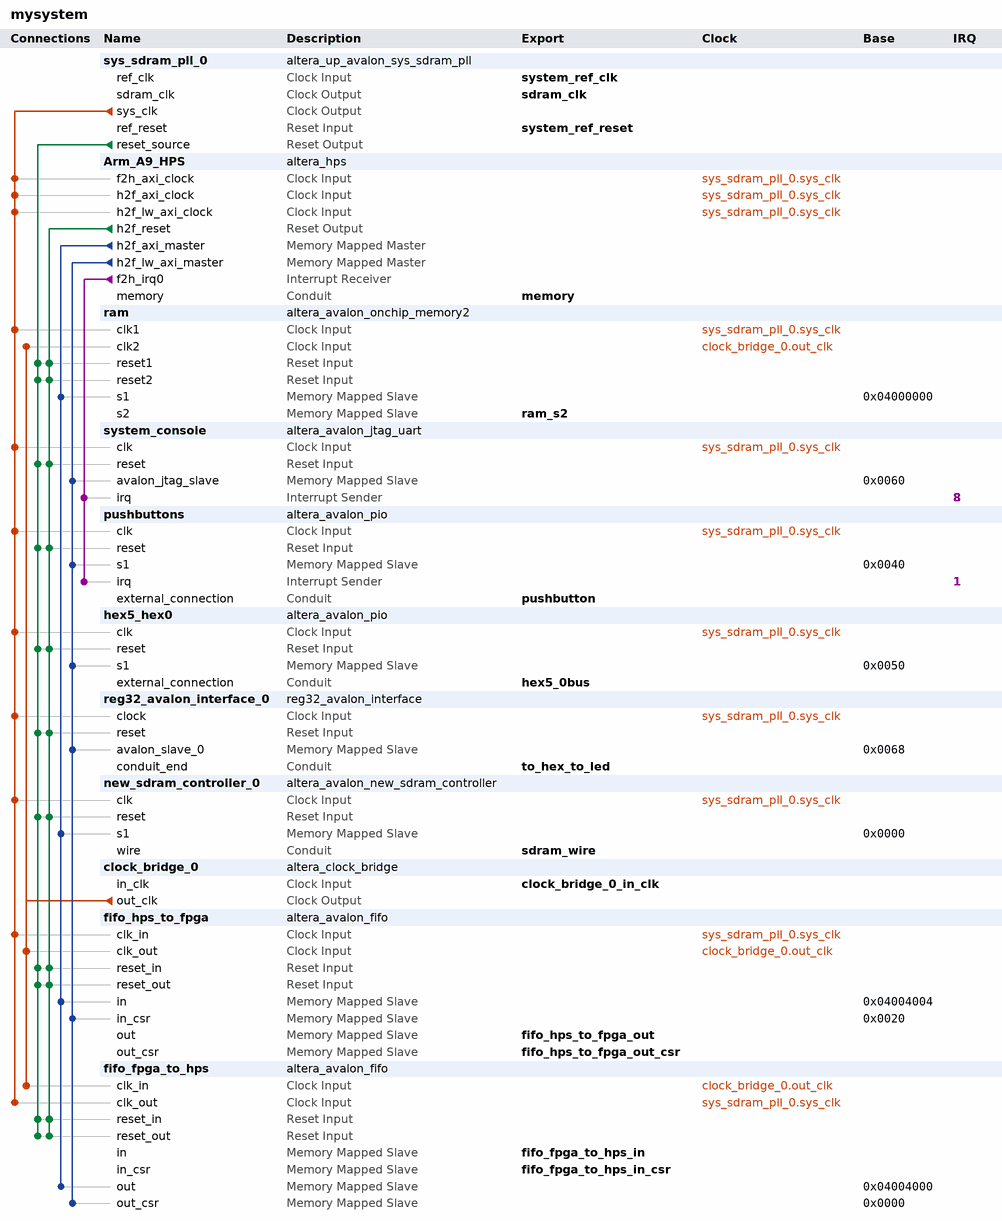
[diagram p0: system contents]
# Platform Designer (Qsys) system mysystem, Cyclone V 5CSEMA5F31C6
# Parameters at their usual value, and those the tool derives, are not listed.
package require -exact qsys 15.0
create_system mysystem
set_project_property DEVICE_FAMILY {Cyclone V}
set_project_property DEVICE 5CSEMA5F31C6

add_instance sys_sdram_pll_0 altera_up_avalon_sys_sdram_pll 15.0
set_instance_parameter_value sys_sdram_pll_0 CV_boards DE1-SoC
set_instance_parameter_value sys_sdram_pll_0 gui_outclk 50.0
set_instance_parameter_value sys_sdram_pll_0 gui_refclk 50.0

add_instance Arm_A9_HPS altera_hps 15.0
set_instance_parameter_value Arm_A9_HPS EMAC1_Mode N/A
set_instance_parameter_value Arm_A9_HPS EMAC1_PinMuxing Unused
set_instance_parameter_value Arm_A9_HPS F2SCLK_COLDRST_Enable false
set_instance_parameter_value Arm_A9_HPS F2SCLK_DBGRST_Enable false
set_instance_parameter_value Arm_A9_HPS F2SCLK_WARMRST_Enable false
set_instance_parameter_value Arm_A9_HPS F2SINTERRUPT_Enable true
set_instance_parameter_value Arm_A9_HPS F2S_Width 2
set_instance_parameter_value Arm_A9_HPS FPGA_PERIPHERAL_OUTPUT_CLOCK_FREQ_EMAC0_GTX_CLK 100
set_instance_parameter_value Arm_A9_HPS FPGA_PERIPHERAL_OUTPUT_CLOCK_FREQ_EMAC0_MD_CLK 2.5
set_instance_parameter_value Arm_A9_HPS FPGA_PERIPHERAL_OUTPUT_CLOCK_FREQ_EMAC1_GTX_CLK 100
set_instance_parameter_value Arm_A9_HPS FPGA_PERIPHERAL_OUTPUT_CLOCK_FREQ_EMAC1_MD_CLK 2.5
set_instance_parameter_value Arm_A9_HPS HPS_PROTOCOL DDR3
set_instance_parameter_value Arm_A9_HPS I2C0_Mode N/A
set_instance_parameter_value Arm_A9_HPS I2C0_PinMuxing Unused
set_instance_parameter_value Arm_A9_HPS I2C1_Mode N/A
set_instance_parameter_value Arm_A9_HPS I2C1_PinMuxing Unused
set_instance_parameter_value Arm_A9_HPS LWH2F_Enable true
set_instance_parameter_value Arm_A9_HPS MEM_BANKADDR_WIDTH 3
set_instance_parameter_value Arm_A9_HPS MEM_CLK_FREQ 300.0
set_instance_parameter_value Arm_A9_HPS MEM_CLK_FREQ_MAX 400.0
set_instance_parameter_value Arm_A9_HPS MEM_COL_ADDR_WIDTH 8
set_instance_parameter_value Arm_A9_HPS MEM_DQ_WIDTH 8
set_instance_parameter_value Arm_A9_HPS MEM_DRV_STR RZQ/6
set_instance_parameter_value Arm_A9_HPS MEM_ROW_ADDR_WIDTH 12
set_instance_parameter_value Arm_A9_HPS MEM_RTT_NOM RZQ/6
set_instance_parameter_value Arm_A9_HPS MEM_RTT_WR {Dynamic ODT off}
set_instance_parameter_value Arm_A9_HPS MEM_TCL 7
set_instance_parameter_value Arm_A9_HPS MEM_TFAW_NS 37.5
set_instance_parameter_value Arm_A9_HPS MEM_TINIT_US 499
set_instance_parameter_value Arm_A9_HPS MEM_TMRD_CK 3
set_instance_parameter_value Arm_A9_HPS MEM_TRAS_NS 40.0
set_instance_parameter_value Arm_A9_HPS MEM_TRCD_NS 15.0
set_instance_parameter_value Arm_A9_HPS MEM_TREFI_US 7.0
set_instance_parameter_value Arm_A9_HPS MEM_TRFC_NS 75.0
set_instance_parameter_value Arm_A9_HPS MEM_TRP_NS 15.0
set_instance_parameter_value Arm_A9_HPS MEM_TWTR 2
set_instance_parameter_value Arm_A9_HPS MEM_VENDOR JEDEC
set_instance_parameter_value Arm_A9_HPS MEM_WTCL 6
set_instance_parameter_value Arm_A9_HPS QSPI_Mode N/A
set_instance_parameter_value Arm_A9_HPS QSPI_PinMuxing Unused
set_instance_parameter_value Arm_A9_HPS REF_CLK_FREQ 125.0
set_instance_parameter_value Arm_A9_HPS S2F_Width 3
set_instance_parameter_value Arm_A9_HPS SDIO_Mode N/A
set_instance_parameter_value Arm_A9_HPS SDIO_PinMuxing Unused
set_instance_parameter_value Arm_A9_HPS SPIM1_Mode N/A
set_instance_parameter_value Arm_A9_HPS SPIM1_PinMuxing Unused
set_instance_parameter_value Arm_A9_HPS STM_Enable false
set_instance_parameter_value Arm_A9_HPS TIMING_BOARD_AC_SKEW 0.02
set_instance_parameter_value Arm_A9_HPS TIMING_BOARD_AC_TO_CK_SKEW 0.0
set_instance_parameter_value Arm_A9_HPS TIMING_BOARD_DQ_TO_DQS_SKEW 0.0
set_instance_parameter_value Arm_A9_HPS TIMING_BOARD_MAX_CK_DELAY 0.6
set_instance_parameter_value Arm_A9_HPS TIMING_BOARD_MAX_DQS_DELAY 0.6
set_instance_parameter_value Arm_A9_HPS TIMING_BOARD_SKEW_BETWEEN_DQS 0.02
set_instance_parameter_value Arm_A9_HPS TIMING_BOARD_SKEW_CKDQS_DIMM_MAX 0.01
set_instance_parameter_value Arm_A9_HPS TIMING_BOARD_SKEW_CKDQS_DIMM_MIN -0.01
set_instance_parameter_value Arm_A9_HPS TIMING_BOARD_SKEW_WITHIN_DQS 0.02
set_instance_parameter_value Arm_A9_HPS TIMING_TDH 125
set_instance_parameter_value Arm_A9_HPS TIMING_TDQSCK 400
set_instance_parameter_value Arm_A9_HPS TIMING_TDQSQ 120
set_instance_parameter_value Arm_A9_HPS TIMING_TDS 50
set_instance_parameter_value Arm_A9_HPS TIMING_TIH 250
set_instance_parameter_value Arm_A9_HPS TIMING_TIS 175
set_instance_parameter_value Arm_A9_HPS TIMING_TQSH 0.38
set_instance_parameter_value Arm_A9_HPS UART0_Mode N/A
set_instance_parameter_value Arm_A9_HPS UART0_PinMuxing Unused
set_instance_parameter_value Arm_A9_HPS USB1_Mode N/A
set_instance_parameter_value Arm_A9_HPS USB1_PinMuxing Unused
set_instance_parameter_value Arm_A9_HPS desired_cfg_clk_mhz 100.0
set_instance_parameter_value Arm_A9_HPS desired_qspi_clk_mhz 400.0

add_instance ram altera_avalon_onchip_memory2 15.0
set_instance_parameter_value ram dataWidth 32
set_instance_parameter_value ram dualPort true
set_instance_parameter_value ram initMemContent true
set_instance_parameter_value ram initializationFileName onchip_mem.hex
set_instance_parameter_value ram memorySize 16384

add_instance system_console altera_avalon_jtag_uart 15.0
set_instance_parameter_value system_console simInteractiveOptions NO_INTERACTIVE_WINDOWS

add_instance pushbuttons altera_avalon_pio 15.0
set_instance_parameter_value pushbuttons bitClearingEdgeCapReg true
set_instance_parameter_value pushbuttons captureEdge true
set_instance_parameter_value pushbuttons direction Input
set_instance_parameter_value pushbuttons edgeType FALLING
set_instance_parameter_value pushbuttons generateIRQ true
set_instance_parameter_value pushbuttons irqType EDGE
set_instance_parameter_value pushbuttons simDoTestBenchWiring true
set_instance_parameter_value pushbuttons width 4

add_instance hex5_hex0 altera_avalon_pio 15.0
set_instance_parameter_value hex5_hex0 direction Output
set_instance_parameter_value hex5_hex0 width 32

add_instance reg32_avalon_interface_0 reg32_avalon_interface 1.0

add_instance new_sdram_controller_0 altera_avalon_new_sdram_controller 15.0
set_instance_parameter_value new_sdram_controller_0 TAC 5.5
set_instance_parameter_value new_sdram_controller_0 TRCD 20.0
set_instance_parameter_value new_sdram_controller_0 TRP 20.0
set_instance_parameter_value new_sdram_controller_0 casLatency 3
set_instance_parameter_value new_sdram_controller_0 columnWidth 10
set_instance_parameter_value new_sdram_controller_0 dataWidth 16
set_instance_parameter_value new_sdram_controller_0 generateSimulationModel false
set_instance_parameter_value new_sdram_controller_0 model single_Micron_MT48LC4M32B2_7_chip
set_instance_parameter_value new_sdram_controller_0 numberOfBanks 4
set_instance_parameter_value new_sdram_controller_0 numberOfChipSelects 1
set_instance_parameter_value new_sdram_controller_0 powerUpDelay 100.0
set_instance_parameter_value new_sdram_controller_0 refreshPeriod 15.625
set_instance_parameter_value new_sdram_controller_0 rowWidth 13

add_instance clock_bridge_0 altera_clock_bridge 15.0
set_instance_parameter_value clock_bridge_0 DERIVED_CLOCK_RATE 0
set_instance_parameter_value clock_bridge_0 EXPLICIT_CLOCK_RATE 0

add_instance fifo_hps_to_fpga altera_avalon_fifo 15.0
set_instance_parameter_value fifo_hps_to_fpga bitsPerSymbol 16
set_instance_parameter_value fifo_hps_to_fpga channelWidth 8
set_instance_parameter_value fifo_hps_to_fpga errorWidth 8
set_instance_parameter_value fifo_hps_to_fpga fifoDepth 128
set_instance_parameter_value fifo_hps_to_fpga fifoInputInterfaceOptions AVALONMM_WRITE
set_instance_parameter_value fifo_hps_to_fpga fifoOutputInterfaceOptions AVALONMM_READ
set_instance_parameter_value fifo_hps_to_fpga singleClockMode false
set_instance_parameter_value fifo_hps_to_fpga symbolsPerBeat 2
set_instance_parameter_value fifo_hps_to_fpga useIRQ false
set_instance_parameter_value fifo_hps_to_fpga usePacket true
set_instance_parameter_value fifo_hps_to_fpga useReadControl true

add_instance fifo_fpga_to_hps altera_avalon_fifo 15.0
set_instance_parameter_value fifo_fpga_to_hps bitsPerSymbol 16
set_instance_parameter_value fifo_fpga_to_hps channelWidth 8
set_instance_parameter_value fifo_fpga_to_hps errorWidth 8
set_instance_parameter_value fifo_fpga_to_hps fifoDepth 128
set_instance_parameter_value fifo_fpga_to_hps fifoInputInterfaceOptions AVALONMM_WRITE
set_instance_parameter_value fifo_fpga_to_hps fifoOutputInterfaceOptions AVALONMM_READ
set_instance_parameter_value fifo_fpga_to_hps singleClockMode false
set_instance_parameter_value fifo_fpga_to_hps symbolsPerBeat 2
set_instance_parameter_value fifo_fpga_to_hps useIRQ false
set_instance_parameter_value fifo_fpga_to_hps usePacket true
set_instance_parameter_value fifo_fpga_to_hps useReadControl true

# connections
add_connection clock_bridge_0.out_clk fifo_fpga_to_hps.clk_in clock
add_connection clock_bridge_0.out_clk fifo_hps_to_fpga.clk_out clock
add_connection clock_bridge_0.out_clk ram.clk2 clock
add_connection sys_sdram_pll_0.sys_clk Arm_A9_HPS.f2h_axi_clock clock
add_connection sys_sdram_pll_0.sys_clk Arm_A9_HPS.h2f_axi_clock clock
add_connection sys_sdram_pll_0.sys_clk Arm_A9_HPS.h2f_lw_axi_clock clock
add_connection sys_sdram_pll_0.sys_clk fifo_fpga_to_hps.clk_out clock
add_connection sys_sdram_pll_0.sys_clk fifo_hps_to_fpga.clk_in clock
add_connection sys_sdram_pll_0.sys_clk hex5_hex0.clk clock
add_connection sys_sdram_pll_0.sys_clk new_sdram_controller_0.clk clock
add_connection sys_sdram_pll_0.sys_clk pushbuttons.clk clock
add_connection sys_sdram_pll_0.sys_clk ram.clk1 clock
add_connection sys_sdram_pll_0.sys_clk reg32_avalon_interface_0.clock clock
add_connection sys_sdram_pll_0.sys_clk system_console.clk clock
add_connection Arm_A9_HPS.h2f_reset fifo_fpga_to_hps.reset_in reset
add_connection Arm_A9_HPS.h2f_reset fifo_fpga_to_hps.reset_out reset
add_connection Arm_A9_HPS.h2f_reset fifo_hps_to_fpga.reset_in reset
add_connection Arm_A9_HPS.h2f_reset fifo_hps_to_fpga.reset_out reset
add_connection Arm_A9_HPS.h2f_reset hex5_hex0.reset reset
add_connection Arm_A9_HPS.h2f_reset new_sdram_controller_0.reset reset
add_connection Arm_A9_HPS.h2f_reset pushbuttons.reset reset
add_connection Arm_A9_HPS.h2f_reset ram.reset1 reset
add_connection Arm_A9_HPS.h2f_reset ram.reset2 reset
add_connection Arm_A9_HPS.h2f_reset reg32_avalon_interface_0.reset reset
add_connection Arm_A9_HPS.h2f_reset system_console.reset reset
add_connection sys_sdram_pll_0.reset_source fifo_fpga_to_hps.reset_in reset
add_connection sys_sdram_pll_0.reset_source fifo_fpga_to_hps.reset_out reset
add_connection sys_sdram_pll_0.reset_source fifo_hps_to_fpga.reset_in reset
add_connection sys_sdram_pll_0.reset_source fifo_hps_to_fpga.reset_out reset
add_connection sys_sdram_pll_0.reset_source hex5_hex0.reset reset
add_connection sys_sdram_pll_0.reset_source new_sdram_controller_0.reset reset
add_connection sys_sdram_pll_0.reset_source pushbuttons.reset reset
add_connection sys_sdram_pll_0.reset_source ram.reset1 reset
add_connection sys_sdram_pll_0.reset_source ram.reset2 reset
add_connection sys_sdram_pll_0.reset_source reg32_avalon_interface_0.reset reset
add_connection sys_sdram_pll_0.reset_source system_console.reset reset
add_connection Arm_A9_HPS.h2f_axi_master fifo_fpga_to_hps.out avalon
set_connection_parameter_value Arm_A9_HPS.h2f_axi_master/fifo_fpga_to_hps.out baseAddress 0x04004000
add_connection Arm_A9_HPS.h2f_axi_master fifo_hps_to_fpga.in avalon
set_connection_parameter_value Arm_A9_HPS.h2f_axi_master/fifo_hps_to_fpga.in baseAddress 0x04004004
add_connection Arm_A9_HPS.h2f_axi_master new_sdram_controller_0.s1 avalon
set_connection_parameter_value Arm_A9_HPS.h2f_axi_master/new_sdram_controller_0.s1 baseAddress 0x0000
add_connection Arm_A9_HPS.h2f_axi_master ram.s1 avalon
set_connection_parameter_value Arm_A9_HPS.h2f_axi_master/ram.s1 baseAddress 0x04000000
add_connection Arm_A9_HPS.h2f_lw_axi_master fifo_fpga_to_hps.out_csr avalon
set_connection_parameter_value Arm_A9_HPS.h2f_lw_axi_master/fifo_fpga_to_hps.out_csr baseAddress 0x0000
add_connection Arm_A9_HPS.h2f_lw_axi_master fifo_hps_to_fpga.in_csr avalon
set_connection_parameter_value Arm_A9_HPS.h2f_lw_axi_master/fifo_hps_to_fpga.in_csr baseAddress 0x0020
add_connection Arm_A9_HPS.h2f_lw_axi_master hex5_hex0.s1 avalon
set_connection_parameter_value Arm_A9_HPS.h2f_lw_axi_master/hex5_hex0.s1 baseAddress 0x0050
add_connection Arm_A9_HPS.h2f_lw_axi_master pushbuttons.s1 avalon
set_connection_parameter_value Arm_A9_HPS.h2f_lw_axi_master/pushbuttons.s1 baseAddress 0x0040
add_connection Arm_A9_HPS.h2f_lw_axi_master reg32_avalon_interface_0.avalon_slave_0 avalon
set_connection_parameter_value Arm_A9_HPS.h2f_lw_axi_master/reg32_avalon_interface_0.avalon_slave_0 baseAddress 0x0068
add_connection Arm_A9_HPS.h2f_lw_axi_master system_console.avalon_jtag_slave avalon
set_connection_parameter_value Arm_A9_HPS.h2f_lw_axi_master/system_console.avalon_jtag_slave baseAddress 0x0060
add_connection Arm_A9_HPS.f2h_irq0 pushbuttons.irq interrupt
set_connection_parameter_value Arm_A9_HPS.f2h_irq0/pushbuttons.irq irqNumber 1
add_connection Arm_A9_HPS.f2h_irq0 system_console.irq interrupt
set_connection_parameter_value Arm_A9_HPS.f2h_irq0/system_console.irq irqNumber 8

# exported interfaces
add_interface clock_bridge_0_in_clk clock sink
set_interface_property clock_bridge_0_in_clk EXPORT_OF clock_bridge_0.in_clk
add_interface fifo_fpga_to_hps_in avalon slave
set_interface_property fifo_fpga_to_hps_in EXPORT_OF fifo_fpga_to_hps.in
add_interface fifo_fpga_to_hps_in_csr avalon slave
set_interface_property fifo_fpga_to_hps_in_csr EXPORT_OF fifo_fpga_to_hps.in_csr
add_interface fifo_hps_to_fpga_out avalon slave
set_interface_property fifo_hps_to_fpga_out EXPORT_OF fifo_hps_to_fpga.out
add_interface fifo_hps_to_fpga_out_csr avalon slave
set_interface_property fifo_hps_to_fpga_out_csr EXPORT_OF fifo_hps_to_fpga.out_csr
add_interface hex5_0bus conduit end
set_interface_property hex5_0bus EXPORT_OF hex5_hex0.external_connection
add_interface memory conduit end
set_interface_property memory EXPORT_OF Arm_A9_HPS.memory
add_interface pushbutton conduit end
set_interface_property pushbutton EXPORT_OF pushbuttons.external_connection
add_interface ram_s2 avalon slave
set_interface_property ram_s2 EXPORT_OF ram.s2
add_interface sdram_clk clock source
set_interface_property sdram_clk EXPORT_OF sys_sdram_pll_0.sdram_clk
add_interface sdram_wire conduit end
set_interface_property sdram_wire EXPORT_OF new_sdram_controller_0.wire
add_interface system_ref_clk clock sink
set_interface_property system_ref_clk EXPORT_OF sys_sdram_pll_0.ref_clk
add_interface system_ref_reset reset sink
set_interface_property system_ref_reset EXPORT_OF sys_sdram_pll_0.ref_reset
add_interface to_hex_to_led conduit end
set_interface_property to_hex_to_led EXPORT_OF reg32_avalon_interface_0.conduit_end

set_interconnect_requirement {$system} qsys_mm.clockCrossingAdapter HANDSHAKE
set_interconnect_requirement {$system} qsys_mm.enableEccProtection FALSE
set_interconnect_requirement {$system} qsys_mm.insertDefaultSlave FALSE
set_interconnect_requirement {$system} qsys_mm.maxAdditionalLatency 1

save_system mysystem.qsys
